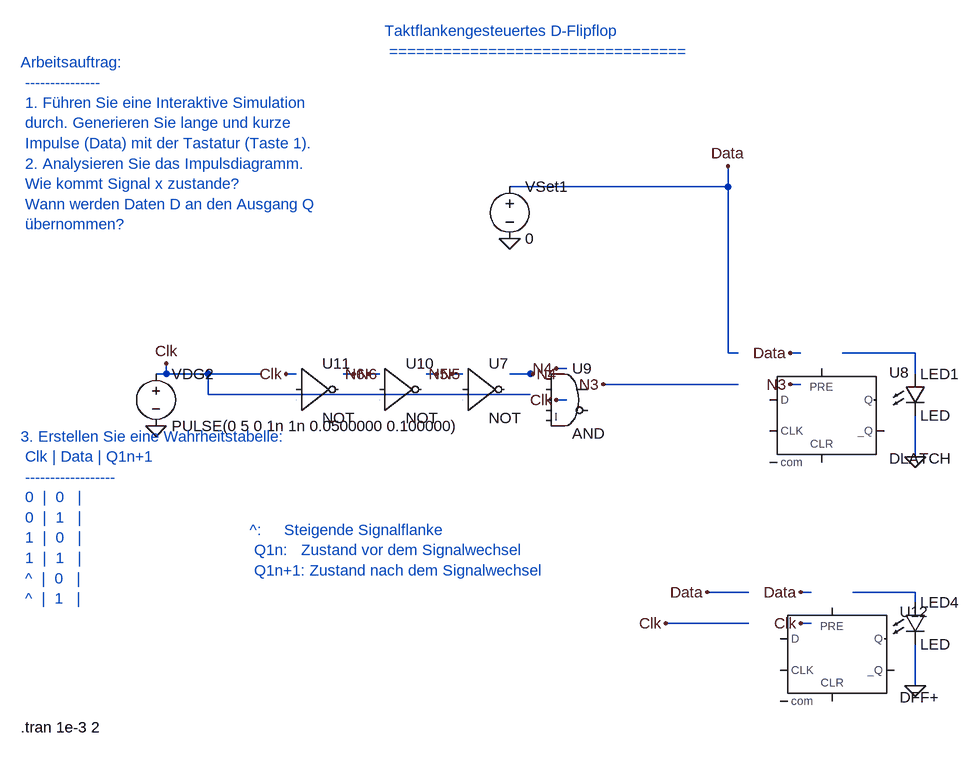
[diagram p0: schematic 6_1_4_Taktflankengesteuertes_D_Flipflop.asc]
6_1_4_Taktflankengesteuertes_D_Flipflop.asc, the LTspice schematic file:
Version 4
SHEET 1 880 680
WIRE 1440 640 1440 672
WIRE 1440 992 1440 1024
WIRE 1440 704 1440 672
WIRE 1328 544 1440 544
WIRE 1440 544 1440 576
WIRE 976 592 1168 592
WIRE 816 576 848 576
WIRE 272 576 288 576
WIRE 352 576 432 576
WIRE 848 608 352 608
WIRE 352 608 352 576
WIRE 816 288 1152 288
WIRE 1120 912 1184 912
WIRE 1152 288 1152 544
WIRE 1152 544 1168 544
WIRE 1152 256 1152 288
WIRE 288 576 352 576
WIRE 288 560 288 576
WIRE 1056 960 1184 960
WIRE 1440 1056 1440 1024
WIRE 1344 912 1440 912
WIRE 1440 912 1440 928
WIRE 976 592 960 592
WIRE 1264 592 1248 592
WIRE 816 576 852 576
WIRE 904 568 888 568
WIRE 744 576 728 576
WIRE 688 576 704 576
WIRE 616 576 600 576
WIRE 560 576 576 576
WIRE 1264 544 1248 544
WIRE 1280 912 1264 912
WIRE 488 576 472 576
WIRE 904 616 888 616
WIRE 1280 960 1264 960
FLAG 816 368 0
FLAG 272 656 0
FLAG 1440 704 0
FLAG 1440 1056 0
FLAG 1440 704 0
FLAG 1440 1056 0
FLAG 960 592 N3
FLAG 1248 592 N3
FLAG 852 576 N4
FLAG 888 568 N4
FLAG 728 576 N5
FLAG 704 576 N5
FLAG 600 576 N6
FLAG 576 576 N6
FLAG 1152 256 Data
FLAG 1120 912 Data
FLAG 1248 544 Data
FLAG 1264 912 Data
FLAG 288 560 Clk
FLAG 1056 960 Clk
FLAG 472 576 Clk
FLAG 888 616 Clk
FLAG 1264 960 Clk
SYMBOL voltage 816 272 R0
SYMATTR InstName VSet1
SYMATTR Value 0
SYMBOL LED 1424 576 R0
SYMATTR InstName LED1
SYMATTR Value LED
SYMBOL voltage 272 560 R0
SYMATTR InstName VDG2
SYMATTR Value PULSE(0 5 0 1n 1n 0.0500000 0.100000)
SYMBOL Digital\inv 744 536 R0
SYMATTR InstName U7
SYMATTR Value NOT
SYMATTR LibreSpice gate=not;inputs=1;vth=2.5;vhigh=5;pins=In1,Out
SYMBOL Digital\dflop 1296 568 R0
SYMATTR InstName U8
SYMATTR Value DLATCH
SYMATTR LibreSpice kind=dlatch;edge=rising;async=high;vth=2.5;vhigh=5;pins=D,EN,SET,RESET,Q,~Q
SYMBOL Digital\and 904 552 R0
SYMATTR InstName U9
SYMATTR Value AND
SYMATTR LibreSpice gate=and;inputs=2;vth=2.5;vhigh=5;pins=In1,In2,Out
SYMBOL Digital\inv 616 536 R0
SYMATTR InstName U10
SYMATTR Value NOT
SYMATTR LibreSpice gate=not;inputs=1;vth=2.5;vhigh=5;pins=In1,Out
SYMBOL Digital\inv 488 536 R0
SYMATTR InstName U11
SYMATTR Value NOT
SYMATTR LibreSpice gate=not;inputs=1;vth=2.5;vhigh=5;pins=In1,Out
SYMBOL Digital\dflop 1312 936 R0
SYMATTR InstName U12
SYMATTR Value DFF+
SYMATTR LibreSpice kind=dff;edge=rising;async=high;vth=2.5;vhigh=5;pins=D,CLK,SET,RESET,Q,~Q
SYMBOL LED 1424 928 R0
SYMATTR InstName LED4
SYMATTR Value LED
TEXT 64 1120 Left 2 !.tran 1e-3 2
TEXT 624 48 Left 2 ;Taktflankengesteuertes D-Flipflop \n =================================
TEXT 64 96 Left 2 ;Arbeitsauftrag: \n --------------- \n 1. Führen Sie eine Interaktive Simulation \n durch. Generieren Sie lange und kurze \n Impulse (Data) mit der Tastatur (Taste 1). \n 2. Analysieren Sie das Impulsdiagramm. \n Wie kommt Signal x zustande? \n Wann werden Daten D an den Ausgang Q \n übernommen?
TEXT 64 672 Left 2 ;3. Erstellen Sie eine Wahrheitstabelle: \n Clk | Data | Q1n+1 \n ------------------ \n 0  |  0   | \n 0  |  1   | \n 1  |  0   | \n 1  |  1   | \n ^  |  0   | \n ^  |  1   |
TEXT 416 816 Left 2 ;^:     Steigende Signalflanke \n Q1n:   Zustand vor dem Signalwechsel \n Q1n+1: Zustand nach dem Signalwechsel

The netlist it stands for:
* 6_1_4_Taktflankengesteuertes_D_Flipflop.asc
VSet1 Data 0 0
D§LED1 N001 0 LED
VDG2 Clk 0 PULSE(0 5 0 1n 1n 0.0500000 0.100000)
A§U7 0 0 0 0 0 0 0 0 BUF NOT
A§U8 0 0 0 0 0 0 0 0 DFLOP DLATCH
A§U9 0 0 0 0 0 0 0 0 AND AND
A§U10 0 0 0 0 0 0 0 0 BUF NOT
A§U11 0 0 0 0 0 0 0 0 BUF NOT
A§U12 0 0 0 0 0 0 0 0 DFLOP DFF+
D§LED4 N002 0 LED
.model D D
.lib standard.dio
.tran 1e-3 2
* Taktflankengesteuertes D-Flipflop
*  =================================
* Arbeitsauftrag:
*  ---------------
*  1. Führen Sie eine Interaktive Simulation
*  durch. Generieren Sie lange und kurze
*  Impulse (Data) mit der Tastatur (Taste 1).
*  2. Analysieren Sie das Impulsdiagramm.
*  Wie kommt Signal x zustande?
*  Wann werden Daten D an den Ausgang Q
*  übernommen?
* 3. Erstellen Sie eine Wahrheitstabelle:
*  Clk | Data | Q1n+1
*  ------------------
*  0  |  0   |
*  0  |  1   |
*  1  |  0   |
*  1  |  1   |
*  ^  |  0   |
*  ^  |  1   |
* ^:     Steigende Signalflanke
*  Q1n:   Zustand vor dem Signalwechsel
*  Q1n+1: Zustand nach dem Signalwechsel
.backanno
.end